# Altium schematic sheet main.SchDoc
size A4
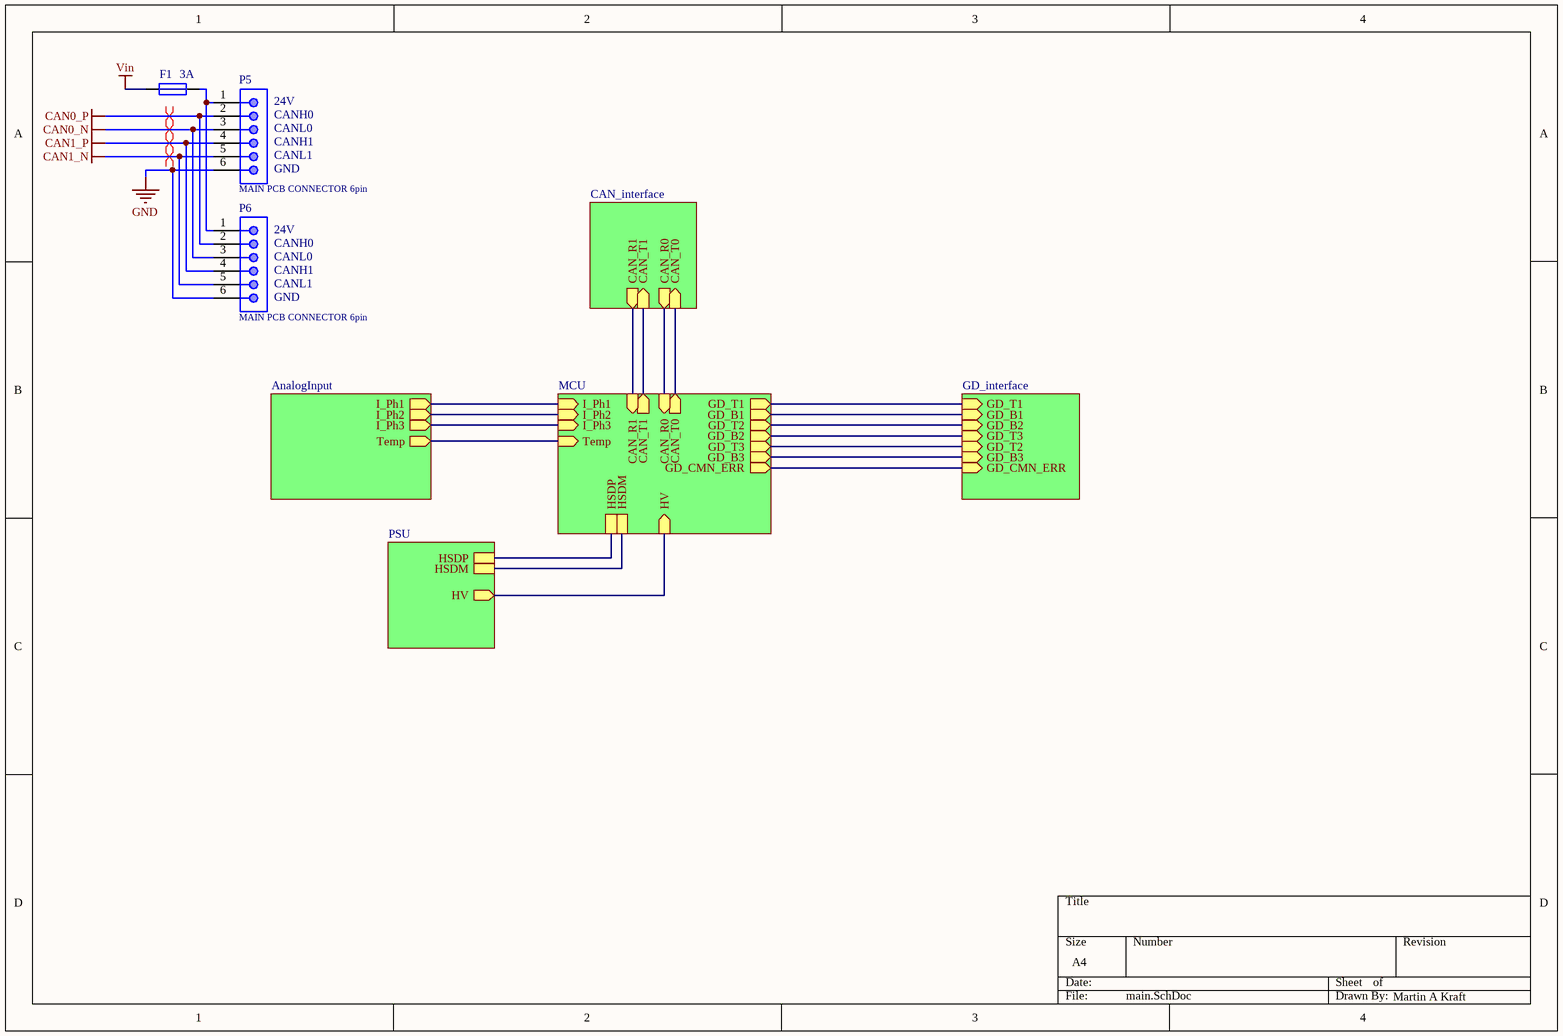
[diagram p0: main.SchDoc]

## Parts
F1  3A  [F_OMH125]
P5  MAIN PCB CONNECTOR 6pin  [662106145021]
P6  MAIN PCB CONNECTOR 6pin  [662106145021]

## Sub-sheets
AnalogInput = InverterControl_AnalogIn.SchDoc: I_Ph1 (out), I_Ph2 (out), I_Ph3 (out), Temp (out)
CAN_interface = CAN_interface.SchDoc: CAN_R0 (out), CAN_T0 (in), CAN_R1 (out), CAN_T1 (in)
GD_interface = GD_interface.SchDoc: GD_T1 (in), GD_B1 (in), GD_T2 (in), GD_B2 (in), GD_T3 (in), GD_B3 (in), GD_CMN_ERR (in)
MCU = MCU.SchDoc: I_Ph1 (in), I_Ph2 (in), I_Ph3 (in), Temp (in), GD_T1 (out), GD_B1 (out), GD_T2 (out), GD_B2 (out), GD_T3 (out), GD_B3 (out), CAN_T0 (out), CAN_R0 (in), CAN_T1 (out), CAN_R1 (in), HSDM, HSDP, HV (in), GD_CMN_ERR (out)
PSU = PSU.SchDoc: HSDM, HSDP, HV (out)

## Nets
CAN0_N: P5.3 P6.3
CAN0_P: P5.2 P6.2
CAN1_N: P5.5 P6.5
CAN1_P: P5.4 P6.4
GND: P5.6 P6.6
Vin: F1.1
NetF1_2: F1.2 P5.1 P6.1
(unnamed): sheet AnalogInput/I_Ph1, sheet MCU/I_Ph1
(unnamed): sheet AnalogInput/I_Ph2, sheet MCU/I_Ph2
(unnamed): sheet AnalogInput/I_Ph3, sheet MCU/I_Ph3
(unnamed): sheet AnalogInput/Temp, sheet MCU/Temp
(unnamed): sheet MCU/GD_T1, sheet GD_interface/GD_T1
(unnamed): sheet MCU/GD_B1, sheet GD_interface/GD_B1
(unnamed): sheet MCU/GD_T2, sheet GD_interface/GD_B2
(unnamed): sheet MCU/GD_B2, sheet GD_interface/GD_T3
(unnamed): sheet MCU/GD_T3, sheet GD_interface/GD_T2
(unnamed): sheet MCU/GD_B3, sheet GD_interface/GD_B3
(unnamed): sheet MCU/CAN_T0, sheet CAN_interface/CAN_T0
(unnamed): sheet MCU/CAN_R0, sheet CAN_interface/CAN_R0
(unnamed): sheet MCU/CAN_T1, sheet CAN_interface/CAN_T1
(unnamed): sheet MCU/CAN_R1, sheet CAN_interface/CAN_R1
(unnamed): sheet MCU/HSDM, sheet PSU/HSDM
(unnamed): sheet MCU/HSDP, sheet PSU/HSDP
(unnamed): sheet MCU/HV, sheet PSU/HV
(unnamed): sheet MCU/GD_CMN_ERR, sheet GD_interface/GD_CMN_ERR

## Layout directives
differential pair: CAN0_N, CAN0_P, CAN1_N, CAN1_P

## Notes on the sheet
- Martin A Kraft
- (in symbol MAIN PCB CONNECTOR 6pin) 24V; CANH0; CANL0; CANH1; CANL1; GND

## Library data of the parts
F1 = F_Fuse: Fuse - universal; ComponentLink1Description: Datasheet; ComponentLink1URL: https://ch.schurter.com/en/datasheet/typ_OMF_63.pdf
P5 P6 = MAIN PCB CONNECTOR 6pin: SMT Male Header WR-MPC3, with SMT Solder Tabs, Right Angled, Single Row, pitch 3 mm, 6 pins; Pitch: 3 mm; Working Voltage: 250 VAC; Contact Resistance: 10 mOhm; Pin Number: 6; ComponentLink1Description: Manufacturer; ComponentLink1URL: http://www.we-online.de; ComponentLink2Description: Datasheet; ComponentLink2URL: https://katalog.we-online.de/em/datasheet/6621xx145021.pdf; Part Number: 662106145021; Published Date: September 2018; Publisher: Wurth Elektronik; Operating Temperature: -40 to 105 degC; Packaging: Tape and Reel; Gender: Male; Mounting Technology: SMT; Orientation: Right Angled